# Altium schematic sheet fpga00-serdes-power.SchDoc
size Tabloid; SheetNumber: 36; SheetTotal: 71
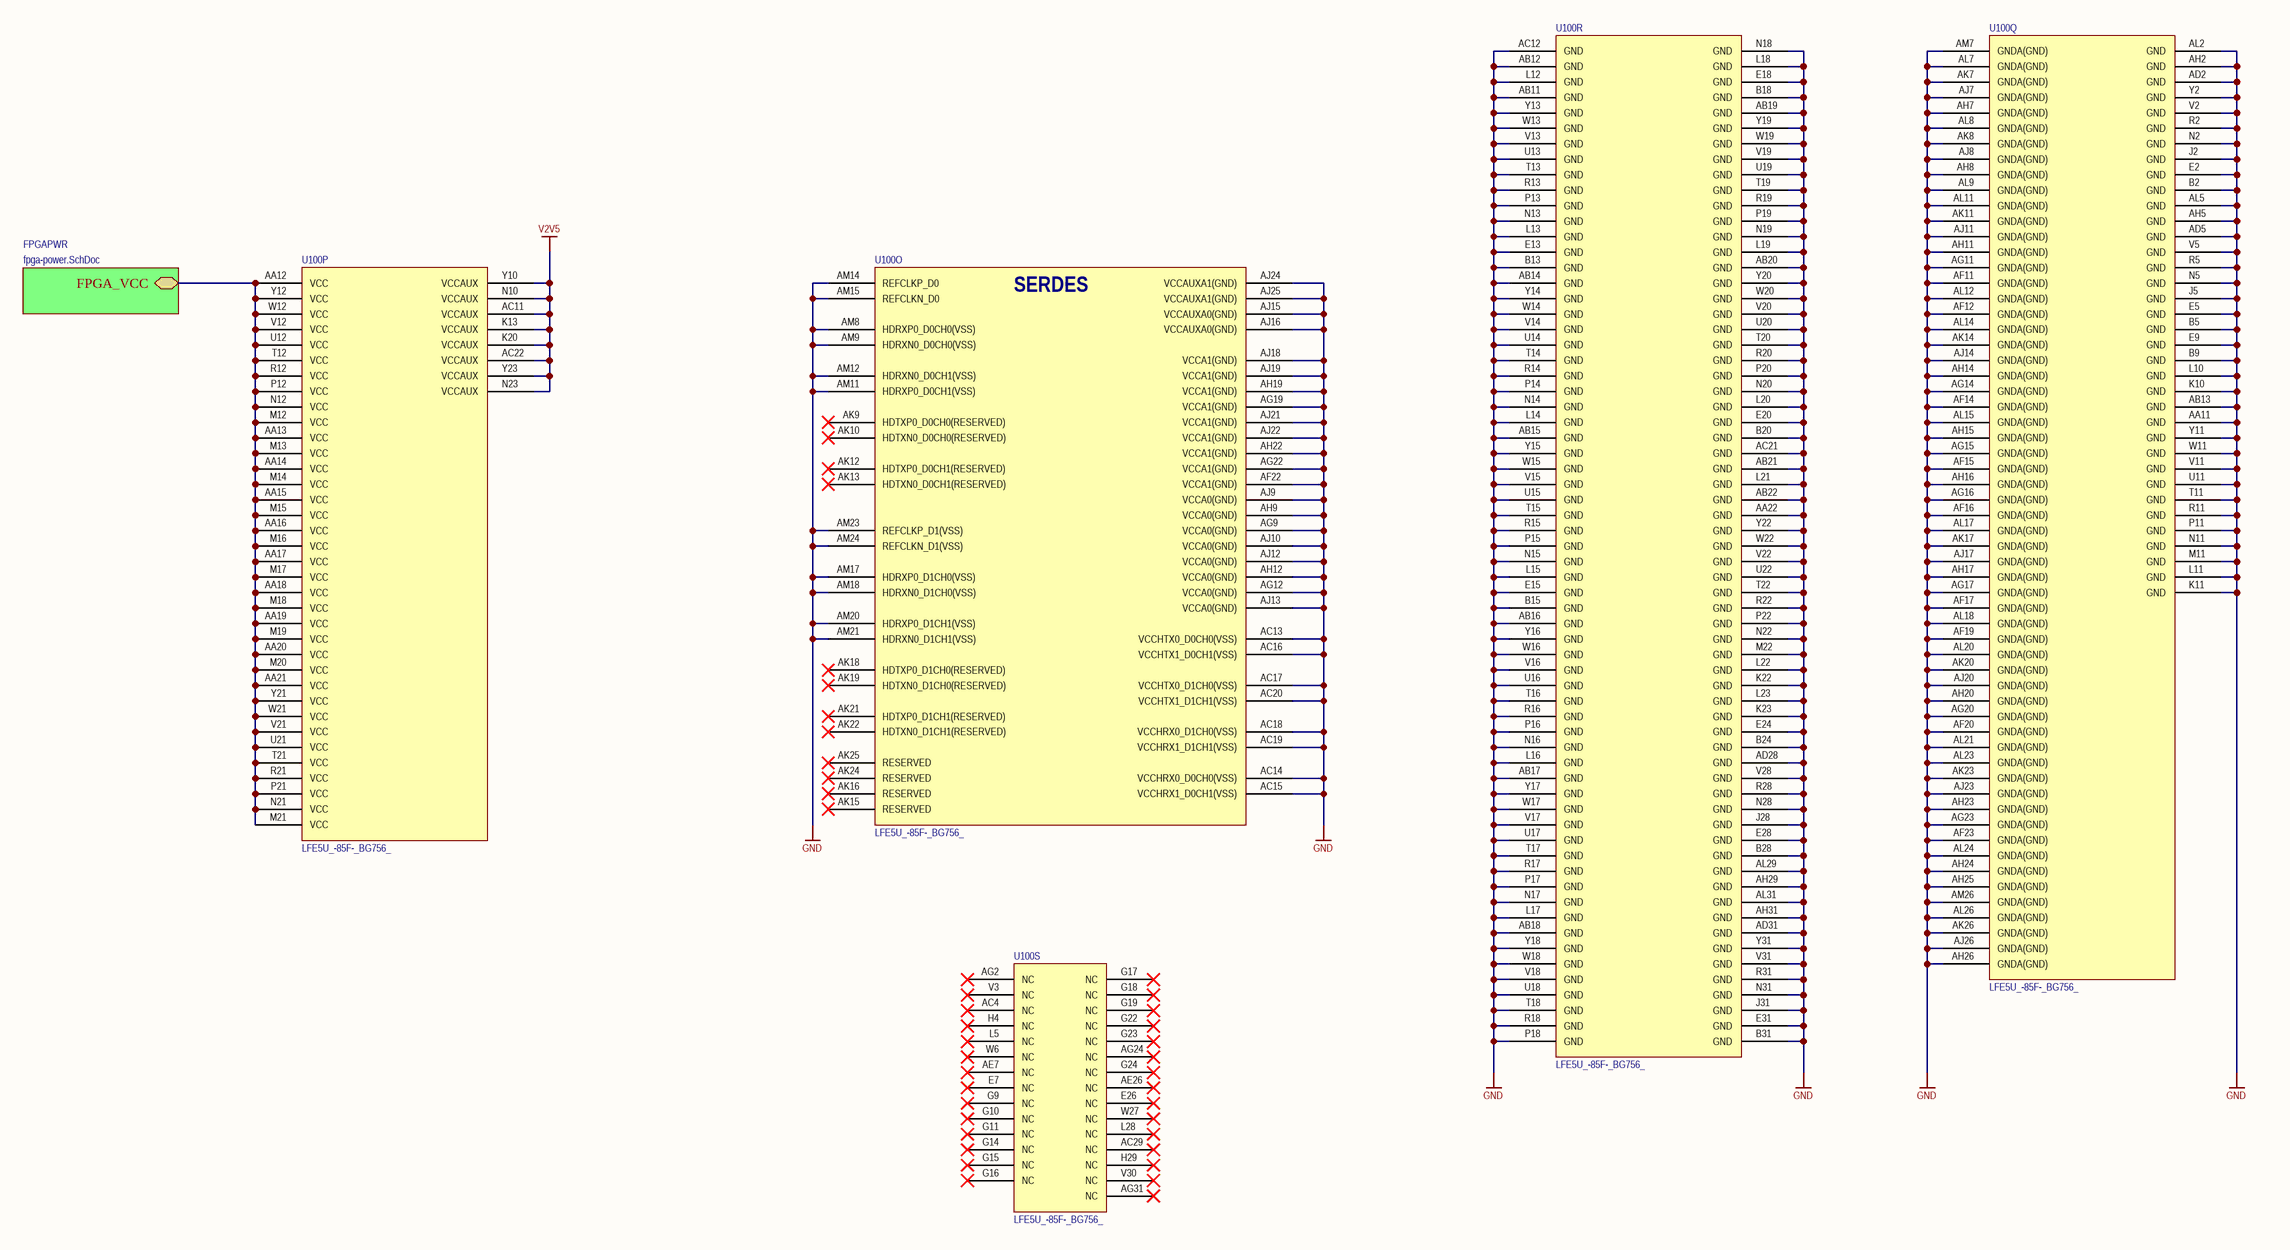
[diagram p0: fpga00-serdes-power.SchDoc]

## Parts
U100  LFE5U_-85F-_BG756_  [caBGA756]  (parts O,P,Q,R,S of 19)

## Sub-sheets
FPGAPWR = fpga-power.SchDoc: FPGA_VCC

## Nets
GND: U100.AA11(GND) U100.AA22(GND) U100.AB11(GND) U100.AB12(GND) U100.AB13(GND) U100.AB14(GND) U100.AB15(GND) U100.AB16(GND) U100.AB17(GND) U100.AB18(GND) U100.AB19(GND) U100.AB20(GND) U100.AB21(GND) U100.AB22(GND) U100.AC12(GND) U100.AC13(VCCHTX0_D0CH0(VSS)) U100.AC14(VCCHRX0_D0CH0(VSS)) U100.AC15(VCCHRX1_D0CH1(VSS)) U100.AC16(VCCHTX1_D0CH1(VSS)) U100.AC17(VCCHTX0_D1CH0(VSS)) U100.AC18(VCCHRX0_D1CH0(VSS)) U100.AC19(VCCHRX1_D1CH1(VSS)) U100.AC20(VCCHTX1_D1CH1(VSS)) U100.AC21(GND) U100.AD2(GND) U100.AD5(GND) U100.AD28(GND) U100.AD31(GND) U100.AF11(GNDA(GND)) U100.AF12(GNDA(GND)) U100.AF14(GNDA(GND)) U100.AF15(GNDA(GND)) U100.AF16(GNDA(GND)) U100.AF17(GNDA(GND)) U100.AF19(GNDA(GND)) U100.AF20(GNDA(GND)) U100.AF22(VCCA1(GND)) U100.AF23(GNDA(GND)) U100.AG9(VCCA0(GND)) U100.AG11(GNDA(GND)) U100.AG12(VCCA0(GND)) U100.AG14(GNDA(GND)) U100.AG15(GNDA(GND)) U100.AG16(GNDA(GND)) U100.AG17(GNDA(GND)) U100.AG19(VCCA1(GND)) U100.AG20(GNDA(GND)) U100.AG22(VCCA1(GND)) U100.AG23(GNDA(GND)) U100.AH2(GND) U100.AH5(GND) U100.AH7(GNDA(GND)) U100.AH8(GNDA(GND)) U100.AH9(VCCA0(GND)) U100.AH11(GNDA(GND)) U100.AH12(VCCA0(GND)) U100.AH14(GNDA(GND)) U100.AH15(GNDA(GND)) U100.AH16(GNDA(GND)) U100.AH17(GNDA(GND)) U100.AH19(VCCA1(GND)) U100.AH20(GNDA(GND)) U100.AH22(VCCA1(GND)) U100.AH23(GNDA(GND)) U100.AH24(GNDA(GND)) U100.AH25(GNDA(GND)) U100.AH26(GNDA(GND)) U100.AH29(GND) U100.AH31(GND) U100.AJ7(GNDA(GND)) U100.AJ8(GNDA(GND)) U100.AJ9(VCCA0(GND)) U100.AJ10(VCCA0(GND)) U100.AJ11(GNDA(GND)) U100.AJ12(VCCA0(GND)) U100.AJ13(VCCA0(GND)) U100.AJ14(GNDA(GND)) U100.AJ15(VCCAUXA0(GND)) U100.AJ16(VCCAUXA0(GND)) U100.AJ17(GNDA(GND)) U100.AJ18(VCCA1(GND)) U100.AJ19(VCCA1(GND)) U100.AJ20(GNDA(GND)) U100.AJ21(VCCA1(GND)) U100.AJ22(VCCA1(GND)) U100.AJ23(GNDA(GND)) U100.AJ24(VCCAUXA1(GND)) U100.AJ25(VCCAUXA1(GND)) U100.AJ26(GNDA(GND)) U100.AK7(GNDA(GND)) U100.AK8(GNDA(GND)) U100.AK11(GNDA(GND)) U100.AK14(GNDA(GND)) U100.AK17(GNDA(GND)) U100.AK20(GNDA(GND)) U100.AK23(GNDA(GND)) U100.AK26(GNDA(GND)) U100.AL2(GND) U100.AL5(GND) U100.AL7(GNDA(GND)) U100.AL8(GNDA(GND)) U100.AL9(GNDA(GND)) U100.AL11(GNDA(GND)) U100.AL12(GNDA(GND)) U100.AL14(GNDA(GND)) U100.AL15(GNDA(GND)) U100.AL17(GNDA(GND)) U100.AL18(GNDA(GND)) U100.AL20(GNDA(GND)) U100.AL21(GNDA(GND)) U100.AL23(GNDA(GND)) U100.AL24(GNDA(GND)) U100.AL26(GNDA(GND)) U100.AL29(GND) U100.AL31(GND) U100.AM7(GNDA(GND)) U100.AM8(HDRXP0_D0CH0(VSS)) U100.AM9(HDRXN0_D0CH0(VSS)) U100.AM11(HDRXP0_D0CH1(VSS)) U100.AM12(HDRXN0_D0CH1(VSS)) U100.AM14(REFCLKP_D0) U100.AM15(REFCLKN_D0) U100.AM17(HDRXP0_D1CH0(VSS)) U100.AM18(HDRXN0_D1CH0(VSS)) U100.AM20(HDRXP0_D1CH1(VSS)) U100.AM21(HDRXN0_D1CH1(VSS)) U100.AM23(REFCLKP_D1(VSS)) U100.AM24(REFCLKN_D1(VSS)) U100.AM26(GNDA(GND)) U100.B2(GND) U100.B5(GND) U100.B9(GND) U100.B13(GND) U100.B15(GND) U100.B18(GND) U100.B20(GND) U100.B24(GND) U100.B28(GND) U100.B31(GND) U100.E2(GND) U100.E5(GND) U100.E9(GND) U100.E13(GND) U100.E15(GND) U100.E18(GND) U100.E20(GND) U100.E24(GND) U100.E28(GND) U100.E31(GND) U100.J2(GND) U100.J5(GND) U100.J28(GND) U100.J31(GND) U100.K10(GND) U100.K11(GND) U100.K22(GND) U100.K23(GND) U100.L10(GND) U100.L11(GND) U100.L12(GND) U100.L13(GND) U100.L14(GND) U100.L15(GND) U100.L16(GND) U100.L17(GND) U100.L18(GND) U100.L19(GND) U100.L20(GND) U100.L21(GND) U100.L22(GND) U100.L23(GND) U100.M11(GND) U100.M22(GND) U100.N2(GND) U100.N5(GND) U100.N11(GND) U100.N13(GND) U100.N14(GND) U100.N15(GND) U100.N16(GND) U100.N17(GND) U100.N18(GND) U100.N19(GND) U100.N20(GND) U100.N22(GND) U100.N28(GND) U100.N31(GND) U100.P11(GND) U100.P13(GND) U100.P14(GND) U100.P15(GND) U100.P16(GND) U100.P17(GND) U100.P18(GND) U100.P19(GND) U100.P20(GND) U100.P22(GND) U100.R2(GND) U100.R5(GND) U100.R11(GND) U100.R13(GND) U100.R14(GND) U100.R15(GND) U100.R16(GND) U100.R17(GND) U100.R18(GND) U100.R19(GND) U100.R20(GND) U100.R22(GND) U100.R28(GND) U100.R31(GND) U100.T11(GND) U100.T13(GND) U100.T14(GND) U100.T15(GND) U100.T16(GND) U100.T17(GND) U100.T18(GND) U100.T19(GND) U100.T20(GND) U100.T22(GND) U100.U11(GND) U100.U13(GND) U100.U14(GND) U100.U15(GND) U100.U16(GND) U100.U17(GND) U100.U18(GND) U100.U19(GND) U100.U20(GND) U100.U22(GND) U100.V2(GND) U100.V5(GND) U100.V11(GND) U100.V13(GND) U100.V14(GND) U100.V15(GND) U100.V16(GND) U100.V17(GND) U100.V18(GND) U100.V19(GND) U100.V20(GND) U100.V22(GND) U100.V28(GND) U100.V31(GND) U100.W11(GND) U100.W13(GND) U100.W14(GND) U100.W15(GND) U100.W16(GND) U100.W17(GND) U100.W18(GND) U100.W19(GND) U100.W20(GND) U100.W22(GND) U100.Y2(GND) U100.Y11(GND) U100.Y13(GND) U100.Y14(GND) U100.Y15(GND) U100.Y16(GND) U100.Y17(GND) U100.Y18(GND) U100.Y19(GND) U100.Y20(GND) U100.Y22(GND) U100.Y31(GND)
V2V5: U100.AC11(VCCAUX) U100.AC22(VCCAUX) U100.K13(VCCAUX) U100.K20(VCCAUX) U100.N10(VCCAUX) U100.N23(VCCAUX) U100.Y10(VCCAUX) U100.Y23(VCCAUX)
NetU100_AA12: U100.AA12(VCC) U100.AA13(VCC) U100.AA14(VCC) U100.AA15(VCC) U100.AA16(VCC) U100.AA17(VCC) U100.AA18(VCC) U100.AA19(VCC) U100.AA20(VCC) U100.AA21(VCC) U100.M12(VCC) U100.M13(VCC) U100.M14(VCC) U100.M15(VCC) U100.M16(VCC) U100.M17(VCC) U100.M18(VCC) U100.M19(VCC) U100.M20(VCC) U100.M21(VCC) U100.N12(VCC) U100.N21(VCC) U100.P12(VCC) U100.P21(VCC) U100.R12(VCC) U100.R21(VCC) U100.T12(VCC) U100.T21(VCC) U100.U12(VCC) U100.U21(VCC) U100.V12(VCC) U100.V21(VCC) U100.W12(VCC) U100.W21(VCC) U100.Y12(VCC) U100.Y21(VCC) ; sheet FPGAPWR/FPGA_VCC

Not connected (* = marked no-connect by the designer): U100 AC4(NC)* AC29(NC)* AE7(NC)* AE26(NC)* AG2(NC)* AG24(NC)* AG31(NC)* AK9(HDTXP0_D0CH0(RESERVED))* AK10(HDTXN0_D0CH0(RESERVED))* AK12(HDTXP0_D0CH1(RESERVED))* AK13(HDTXN0_D0CH1(RESERVED))* AK15(RESERVED)* AK16(RESERVED)* AK18(HDTXP0_D1CH0(RESERVED))* AK19(HDTXN0_D1CH0(RESERVED))* AK21(HDTXP0_D1CH1(RESERVED))* AK22(HDTXN0_D1CH1(RESERVED))* AK24(RESERVED)* AK25(RESERVED)* E7(NC)* E26(NC)* G9(NC)* G10(NC)* G11(NC)* G14(NC)* G15(NC)* G16(NC)* G17(NC)* G18(NC)* G19(NC)* G22(NC)* G23(NC)* G24(NC)* H4(NC)* H29(NC)* L5(NC)* L28(NC)* V3(NC)* V30(NC)* W6(NC)* W27(NC)*

## Notes on the sheet
- (in symbol LFE5U_-85F-_BG756_, part O) SERDES

## Library data of the parts
U100 = LFE5U_-85F-_BG756_: ECP5 FPGA, 85k LUT, 756-caBGA; Manufacturer: Lattice Semiconductor; Manufacturer P/N: LFE5U_-85F-_BG756_